# Altium schematic sheet Input Connector.SchDoc: 220V (HV) Inpıt Connector
size 292 x 193 mm; SheetNumber: 11; SheetTotal: 11
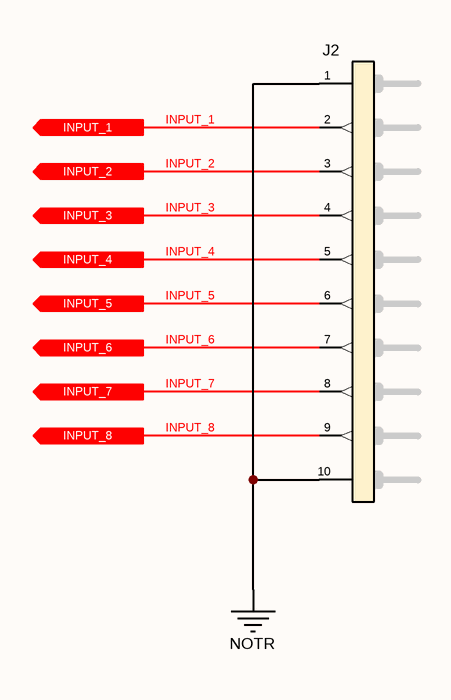
[diagram p0: Input Connector.SchDoc]

## Parts
J2  2.54 mm Pitch 8P Male Connector  [Pin Header 1x10 TH Pitch 2.54mm]  (value not drawn)

## Ports
INPUT_1 (out), INPUT_2 (out), INPUT_3 (out), INPUT_4 (out), INPUT_5 (out), INPUT_6 (out), INPUT_7 (out), INPUT_8 (out)

## Nets
NOTR: J2.1(Pin-1) J2.10(Pin-10)
INPUT_1: J2.2(Pin-2) ; port INPUT_1
INPUT_2: J2.3(Pin-3) ; port INPUT_2
INPUT_3: J2.4(Pin-4) ; port INPUT_3
INPUT_4: J2.5(Pin-5) ; port INPUT_4
INPUT_5: J2.6(Pin-6) ; port INPUT_5
INPUT_6: J2.7(Pin-7) ; port INPUT_6
INPUT_7: J2.8(Pin-8) ; port INPUT_7
INPUT_8: J2.9(Pin-9) ; port INPUT_8

## Notes on the sheet
- © 2021 All rights reserved.
  This document may not, in whole or in part, be copied, photocopied, reproduced, translated or converted to any electronic or machine readable from without prior written permission of Mehmet Günce Akkoyun.
  Engineer contact : akkoyun@me.com
- Property of
- Engineer :
- Date :
- Size :
- A4
- Time :
- Project :
- Page :
- /
- Customer :
- Product ID :
- Module ID :
- Version :
- File :
- Revision :

## Library data of the parts
J2 = Connector - Male Header 10P (2.54): Headers & Wire Housings BREAKAWAY HDR VERT 8; Manufacturer Name: Molex; Position: 10; Row: 1; Pitch: 2.54 mm; Manufacturer Part Number: 22-28-4103; ROHS: Yes